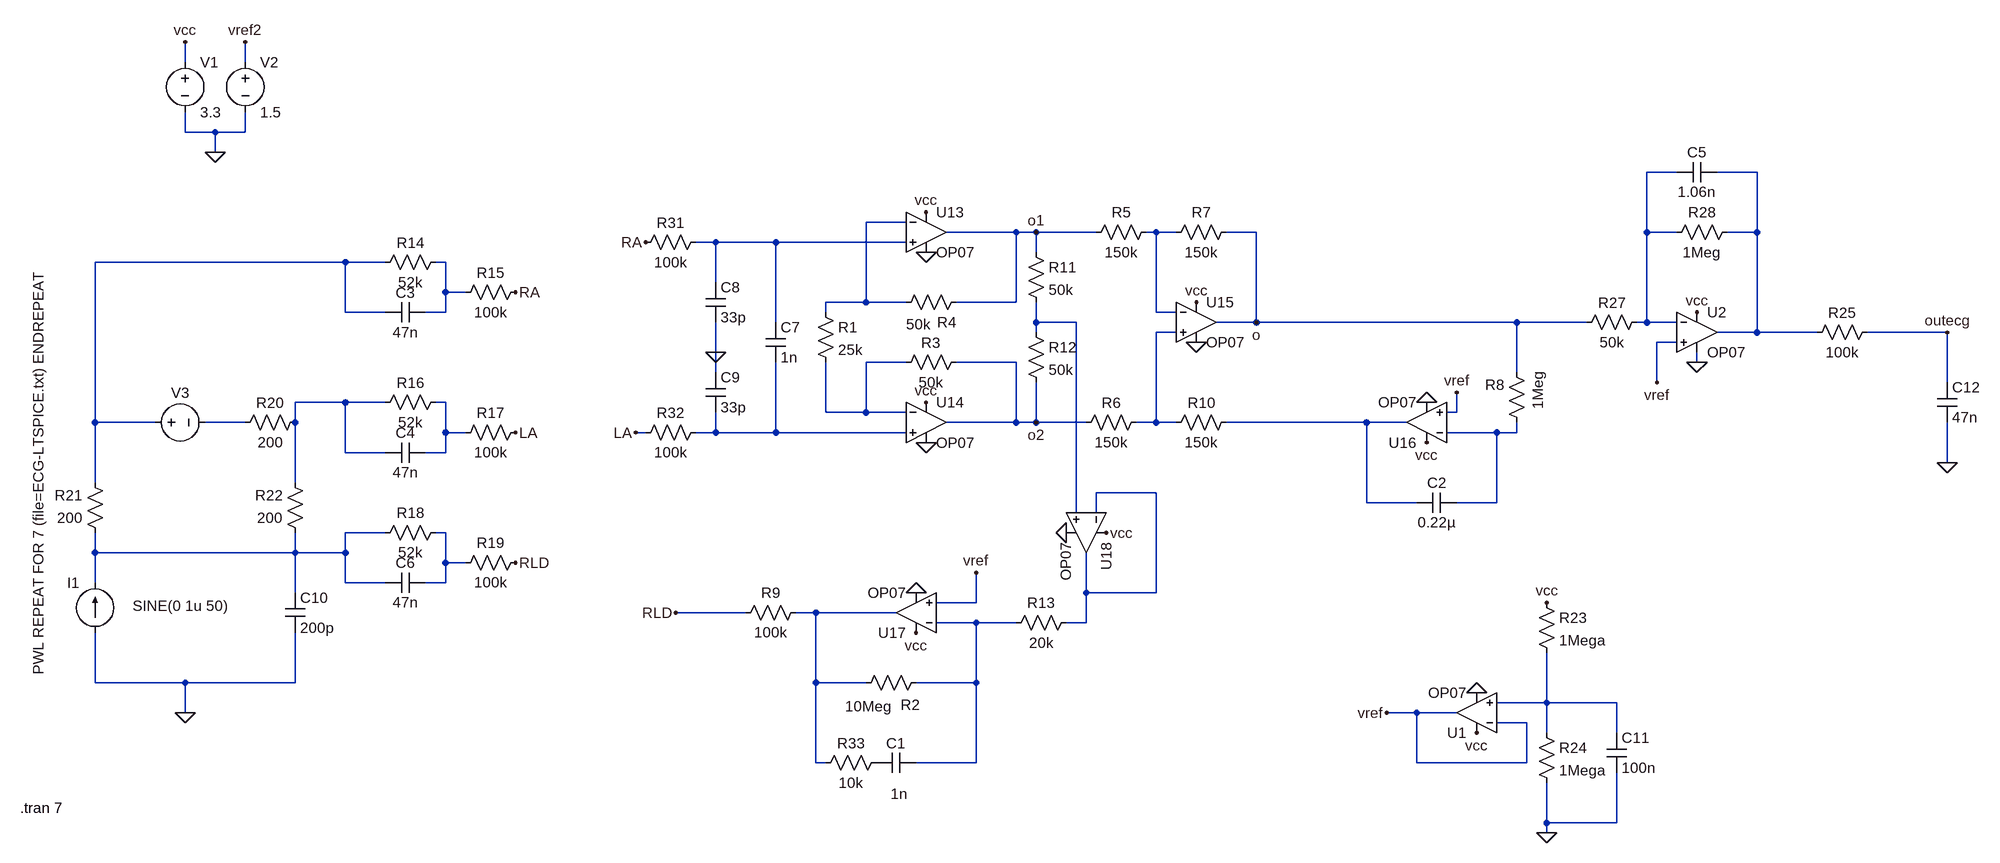
[diagram p0: schematic good circuit.asc]
good circuit.asc, the LTspice schematic file:
Version 4
SHEET 1 3136 1104
WIRE -1920 -208 -1920 -240
WIRE -1824 -208 -1824 -240
WIRE -1920 -96 -1920 -128
WIRE -1872 -96 -1920 -96
WIRE -1824 -96 -1824 -128
WIRE -1824 -96 -1872 -96
WIRE -1872 -64 -1872 -96
WIRE 464 -32 416 -32
WIRE 592 -32 528 -32
WIRE -768 48 -832 48
WIRE -592 64 -704 64
WIRE -560 64 -592 64
WIRE -464 64 -560 64
WIRE -368 64 -384 64
WIRE -336 64 -368 64
WIRE -208 64 -256 64
WIRE 416 64 416 -32
WIRE 464 64 416 64
WIRE 592 64 592 -32
WIRE 592 64 544 64
WIRE -1072 80 -1104 80
WIRE -976 80 -1072 80
WIRE -768 80 -976 80
WIRE -560 96 -560 64
WIRE -1664 112 -2064 112
WIRE -1600 112 -1664 112
WIRE -1504 112 -1520 112
WIRE -1072 144 -1072 80
WIRE -1504 160 -1504 112
WIRE -1472 160 -1504 160
WIRE -832 176 -832 48
WIRE -832 176 -896 176
WIRE -768 176 -832 176
WIRE -592 176 -592 64
WIRE -592 176 -688 176
WIRE -1664 192 -1664 112
WIRE -1600 192 -1664 192
WIRE -1504 192 -1504 160
WIRE -1504 192 -1536 192
WIRE -896 192 -896 176
WIRE -368 192 -368 64
WIRE -336 192 -368 192
WIRE -976 208 -976 80
WIRE -560 208 -560 176
WIRE -496 208 -560 208
WIRE -208 208 -208 64
WIRE -208 208 -272 208
WIRE 208 208 -208 208
WIRE 320 208 208 208
WIRE 416 208 416 64
WIRE 416 208 400 208
WIRE 464 208 416 208
WIRE -560 224 -560 208
WIRE -336 224 -368 224
WIRE 592 224 592 64
WIRE 592 224 528 224
WIRE 688 224 592 224
WIRE 896 224 768 224
WIRE 464 240 432 240
WIRE -1072 256 -1072 208
WIRE -768 272 -832 272
WIRE -592 272 -688 272
WIRE 496 272 496 256
WIRE -1072 288 -1072 256
WIRE 208 288 208 208
WIRE 432 304 432 240
WIRE 896 304 896 224
WIRE -1664 336 -1744 336
WIRE -1600 336 -1664 336
WIRE -1504 336 -1520 336
WIRE -896 352 -896 272
WIRE -832 352 -832 272
WIRE -832 352 -896 352
WIRE -768 352 -832 352
WIRE 112 352 112 320
WIRE 112 352 96 352
WIRE -2064 368 -2064 112
WIRE -1968 368 -2064 368
WIRE -1824 368 -1888 368
WIRE -1744 368 -1744 336
WIRE -592 368 -592 272
WIRE -592 368 -704 368
WIRE -560 368 -560 304
WIRE -560 368 -592 368
WIRE -480 368 -560 368
WIRE -368 368 -368 224
WIRE -368 368 -400 368
WIRE -336 368 -368 368
WIRE -32 368 -256 368
WIRE 32 368 -32 368
WIRE -1504 384 -1504 336
WIRE -1472 384 -1504 384
WIRE -1184 384 -1200 384
WIRE -1072 384 -1072 352
WIRE -1072 384 -1104 384
WIRE -976 384 -976 272
WIRE -976 384 -1072 384
WIRE -768 384 -976 384
WIRE 176 384 96 384
WIRE 208 384 208 368
WIRE 208 384 176 384
WIRE -1664 416 -1664 336
WIRE -1600 416 -1664 416
WIRE -1504 416 -1504 384
WIRE -1504 416 -1536 416
WIRE 896 432 896 368
WIRE -2064 464 -2064 368
WIRE -1744 464 -1744 368
WIRE -368 480 -464 480
WIRE -32 496 -32 368
WIRE 48 496 -32 496
WIRE 176 496 176 384
WIRE 176 496 112 496
WIRE -496 512 -496 208
WIRE -464 512 -464 480
WIRE -1600 544 -1664 544
WIRE -1504 544 -1520 544
WIRE -2064 576 -2064 544
WIRE -1744 576 -1744 544
WIRE -1744 576 -2064 576
WIRE -1664 576 -1664 544
WIRE -1664 576 -1744 576
WIRE -1504 592 -1504 544
WIRE -1472 592 -1504 592
WIRE -2064 624 -2064 576
WIRE -1664 624 -1664 576
WIRE -1600 624 -1664 624
WIRE -1504 624 -1504 592
WIRE -1504 624 -1536 624
WIRE -1744 640 -1744 576
WIRE -480 640 -480 576
WIRE -368 640 -368 480
WIRE -368 640 -480 640
WIRE -656 656 -656 608
WIRE -656 656 -720 656
WIRE -1024 672 -1136 672
WIRE -912 672 -944 672
WIRE -784 672 -912 672
WIRE -656 688 -720 688
WIRE -592 688 -656 688
WIRE -480 688 -480 640
WIRE -480 688 -512 688
WIRE -2064 784 -2064 704
WIRE -1920 784 -2064 784
WIRE -1744 784 -1744 704
WIRE -1744 784 -1920 784
WIRE -912 784 -912 672
WIRE -832 784 -912 784
WIRE -656 784 -656 688
WIRE -656 784 -752 784
WIRE 256 816 256 736
WIRE 256 816 176 816
WIRE 368 816 256 816
WIRE -1920 832 -1920 784
WIRE 48 832 0 832
WIRE 112 832 48 832
WIRE 224 848 176 848
WIRE 256 864 256 816
WIRE 368 864 368 816
WIRE -912 912 -912 784
WIRE -896 912 -912 912
WIRE -656 912 -656 784
WIRE -656 912 -752 912
WIRE 48 912 48 832
WIRE 224 912 224 848
WIRE 224 912 48 912
WIRE 256 1008 256 944
WIRE 368 1008 368 928
WIRE 368 1008 256 1008
WIRE 256 1024 256 1008
FLAG -1872 -64 0
FLAG -1920 -240 vcc
FLAG -656 608 vref
FLAG -752 640 0
FLAG -736 400 0
FLAG -736 96 0
FLAG -304 240 0
FLAG -736 32 vcc
FLAG -752 704 vcc
FLAG -736 336 vcc
FLAG -304 176 vcc
FLAG -560 64 o1
FLAG -560 368 o2
FLAG -448 544 vcc
FLAG -512 544 0
FLAG 64 400 vcc
FLAG 64 336 0
FLAG 112 320 vref
FLAG -208 208 o
FLAG 496 192 vcc
FLAG 496 272 0
FLAG 432 304 vref
FLAG -1072 256 0
FLAG -1920 832 0
FLAG -1392 160 RA
FLAG -1392 384 LA
FLAG -1392 592 RLD
FLAG -1184 80 RA
FLAG -1200 384 LA
FLAG -1136 672 RLD
FLAG 256 1024 0
FLAG 144 864 vcc
FLAG 144 800 0
FLAG 0 832 vref
FLAG 256 656 vcc
FLAG -1824 -240 vref2
FLAG 896 432 0
FLAG 896 224 outecg
SYMBOL res -912 176 R0
SYMATTR InstName R1
SYMATTR Value 25k
SYMBOL res -672 256 R90
WINDOW 0 0 56 VBottom 2
WINDOW 3 32 56 VTop 2
SYMATTR InstName R3
SYMATTR Value 50k
SYMBOL res -672 160 R90
WINDOW 0 63 31 VBottom 2
WINDOW 3 35 76 VTop 2
SYMATTR InstName R4
SYMATTR Value 50k
SYMBOL res -368 48 R90
WINDOW 0 0 56 VBottom 2
WINDOW 3 32 56 VTop 2
SYMATTR InstName R5
SYMATTR Value 150k
SYMBOL res -384 352 R90
WINDOW 0 0 56 VBottom 2
WINDOW 3 32 56 VTop 2
SYMATTR InstName R6
SYMATTR Value 150k
SYMBOL res -240 48 R90
WINDOW 0 0 56 VBottom 2
WINDOW 3 32 56 VTop 2
SYMATTR InstName R7
SYMATTR Value 150k
SYMBOL res -736 768 R90
WINDOW 0 67 25 VBottom 2
WINDOW 3 38 92 VTop 2
SYMATTR InstName R2
SYMATTR Value 10Meg
SYMBOL res -928 656 R90
WINDOW 0 0 56 VBottom 2
WINDOW 3 32 56 VTop 2
SYMATTR InstName R9
SYMATTR Value 100k
SYMBOL res -240 352 R90
WINDOW 0 0 56 VBottom 2
WINDOW 3 32 56 VTop 2
SYMATTR InstName R10
SYMATTR Value 150k
SYMBOL voltage -1920 -224 R0
WINDOW 123 0 0 Left 0
WINDOW 39 0 0 Left 0
SYMATTR InstName V1
SYMATTR Value 3.3
SYMBOL voltage -1824 -224 R0
WINDOW 123 0 0 Left 0
WINDOW 39 0 0 Left 0
SYMATTR InstName V2
SYMATTR Value 1.5
SYMBOL res -576 80 R0
SYMATTR InstName R11
SYMATTR Value 50k
SYMBOL res -576 208 R0
SYMATTR InstName R12
SYMATTR Value 50k
SYMBOL cap -752 896 R90
WINDOW 0 0 32 VBottom 2
WINDOW 3 50 27 VTop 2
SYMATTR InstName C1
SYMATTR Value 1n
SYMBOL res -496 672 R90
WINDOW 0 0 56 VBottom 2
WINDOW 3 32 56 VTop 2
SYMATTR InstName R13
SYMATTR Value 20k
SYMBOL res 224 384 R180
WINDOW 0 36 76 Left 2
WINDOW 3 -18 98 VLeft 2
SYMATTR InstName R8
SYMATTR Value 1Meg
SYMBOL cap 112 480 R90
WINDOW 0 0 32 VBottom 2
WINDOW 3 32 32 VTop 2
SYMATTR InstName C2
SYMATTR Value 0.22µ
SYMBOL OpAmps\\OP07 -736 0 R0
SYMATTR InstName U13
SYMBOL OpAmps\\OP07 -736 304 R0
SYMATTR InstName U14
SYMBOL OpAmps\\OP07 -304 144 R0
SYMATTR InstName U15
SYMBOL OpAmps\\OP07 64 432 R180
SYMATTR InstName U16
SYMBOL OpAmps\\OP07 -752 736 R180
SYMATTR InstName U17
SYMBOL OpAmps\\OP07 -416 544 R90
SYMATTR InstName U18
SYMBOL OpAmps\\OP07 496 160 R0
SYMATTR InstName U2
SYMBOL res 416 192 R90
WINDOW 0 0 56 VBottom 2
WINDOW 3 32 56 VTop 2
SYMATTR InstName R27
SYMATTR Value 50k
SYMBOL res 560 48 R90
WINDOW 0 0 56 VBottom 2
WINDOW 3 32 56 VTop 2
SYMATTR InstName R28
SYMATTR Value 1Meg
SYMBOL cap 528 -48 R90
WINDOW 0 0 32 VBottom 2
WINDOW 3 32 32 VTop 2
SYMATTR InstName C5
SYMATTR Value 1.06n
SYMBOL cap -992 208 R0
SYMATTR InstName C7
SYMATTR Value 1n
SYMBOL cap -1088 144 R0
SYMATTR InstName C8
SYMATTR Value 33p
SYMBOL cap -1088 288 R0
SYMATTR InstName C9
SYMATTR Value 33p
SYMBOL res -1088 64 R90
WINDOW 0 0 56 VBottom 2
WINDOW 3 32 56 VTop 2
SYMATTR InstName R31
SYMATTR Value 100k
SYMBOL res -1088 368 R90
WINDOW 0 0 56 VBottom 2
WINDOW 3 32 56 VTop 2
SYMATTR InstName R32
SYMATTR Value 100k
SYMBOL res -800 896 R90
WINDOW 0 0 56 VBottom 2
WINDOW 3 32 56 VTop 2
SYMATTR InstName R33
SYMATTR Value 10k
SYMBOL res -1616 128 R270
WINDOW 0 32 56 VTop 2
WINDOW 3 0 56 VBottom 2
SYMATTR InstName R14
SYMATTR Value 52k
SYMBOL cap -1536 176 R90
WINDOW 0 0 32 VBottom 2
WINDOW 3 32 32 VTop 2
SYMATTR InstName C3
SYMATTR Value 47n
SYMBOL res -1376 144 R90
WINDOW 0 0 56 VBottom 2
WINDOW 3 32 56 VTop 2
SYMATTR InstName R15
SYMATTR Value 100k
SYMBOL res -1616 352 R270
WINDOW 0 32 56 VTop 2
WINDOW 3 0 56 VBottom 2
SYMATTR InstName R16
SYMATTR Value 52k
SYMBOL cap -1536 400 R90
WINDOW 0 0 32 VBottom 2
WINDOW 3 32 32 VTop 2
SYMATTR InstName C4
SYMATTR Value 47n
SYMBOL res -1376 368 R90
WINDOW 0 0 56 VBottom 2
WINDOW 3 32 56 VTop 2
SYMATTR InstName R17
SYMATTR Value 100k
SYMBOL res -1616 560 R270
WINDOW 0 32 56 VTop 2
WINDOW 3 0 56 VBottom 2
SYMATTR InstName R18
SYMATTR Value 52k
SYMBOL cap -1536 608 R90
WINDOW 0 0 32 VBottom 2
WINDOW 3 32 32 VTop 2
SYMATTR InstName C6
SYMATTR Value 47n
SYMBOL res -1376 576 R90
WINDOW 0 0 56 VBottom 2
WINDOW 3 32 56 VTop 2
SYMATTR InstName R19
SYMATTR Value 100k
SYMBOL voltage -1984 368 R270
WINDOW 0 32 56 VTop 2
WINDOW 3 -81 -155 Bottom 2
SYMATTR InstName V3
SYMATTR Value PWL REPEAT FOR 7 (file=ECG-LTSPICE.txt) ENDREPEAT
SYMBOL res -1728 352 R90
WINDOW 0 0 56 VBottom 2
WINDOW 3 32 56 VTop 2
SYMATTR InstName R20
SYMATTR Value 200
SYMBOL res -2048 560 R180
WINDOW 0 36 76 Left 2
WINDOW 3 36 40 Left 2
SYMATTR InstName R21
SYMATTR Value 200
SYMBOL res -1728 560 R180
WINDOW 0 36 76 Left 2
WINDOW 3 36 40 Left 2
SYMATTR InstName R22
SYMATTR Value 200
SYMBOL current -2064 704 R180
WINDOW 0 24 80 Left 2
WINDOW 3 -213 43 Left 2
WINDOW 123 0 0 Left 0
WINDOW 39 0 0 Left 0
SYMATTR InstName I1
SYMATTR Value SINE(0 1u 50)
SYMBOL cap -1760 640 R0
SYMATTR InstName C10
SYMATTR Value 200p
SYMBOL OpAmps\\OP07 144 896 R180
SYMATTR InstName U1
SYMBOL res 240 640 R0
SYMATTR InstName R23
SYMATTR Value 1Mega
SYMBOL res 240 848 R0
SYMATTR InstName R24
SYMATTR Value 1Mega
SYMBOL cap 352 864 R0
SYMATTR InstName C11
SYMATTR Value 100n
SYMBOL res 784 208 R90
WINDOW 0 0 56 VBottom 2
WINDOW 3 32 56 VTop 2
SYMATTR InstName R25
SYMATTR Value 100k
SYMBOL cap 880 304 R0
SYMATTR InstName C12
SYMATTR Value 47n
TEXT -2184 984 Left 2 !.tran 7

The netlist it stands for:
* good circuit.asc
R1 N003 N010 25k
R3 o2 N010 50k
R4 o1 N003 50k
R5 N004 o1 150k
R6 N009 o2 150k
R7 o N004 150k
R2 N021 N020 10Meg
R9 N020 RLD 100k
R10 N014 N009 150k
V1 vcc 0 3.3
V2 vref2 0 1.5
R11 o1 N008 50k
R12 N008 o2 50k
C1 N021 P001 1n
R13 N017 N021 20k
R8 N016 o 1Meg
C2 N016 N014 0.22µ
XU13 N005 N003 vcc 0 o1 LT1001  ; OP07, pins In+ In- V+ V- OUT
XU14 N015 N010 vcc 0 o2 LT1001  ; OP07, pins In+ In- V+ V- OUT
XU15 N009 N004 vcc 0 o LT1001  ; OP07, pins In+ In- V+ V- OUT
XU16 vref N016 vcc 0 N014 LT1001  ; OP07, pins In+ In- V+ V- OUT
XU17 vref N021 vcc 0 N020 LT1001  ; OP07, pins In+ In- V+ V- OUT
XU18 N008 N017 vcc 0 N017 LT1001  ; OP07, pins In+ In- V+ V- OUT
XU2 vref N001 vcc 0 N002 LT1001  ; OP07, pins In+ In- V+ V- OUT
R27 N001 o 50k
R28 N002 N001 1Meg
C5 N002 N001 1.06n
C7 N005 N015 1n
C8 N005 0 33p
C9 0 N015 33p
R31 N005 RA 100k
R32 N015 LA 100k
R33 P001 N020 10k
R14 N006 N007 52k
C3 N007 N006 47n
R15 RA N007 100k
R16 N011 N012 52k
C4 N012 N011 47n
R17 LA N012 100k
R18 N018 N019 52k
C6 N019 N018 47n
R19 RLD N019 100k
V3 N006 N013 PWL REPEAT FOR 7 (file=ECG-LTSPICE.txt) ENDREPEAT
R20 N011 N013 200
R21 N018 N006 200
R22 N018 N011 200
I1 0 N018 SINE(0 1u 50)
C10 N018 0 200p
XU1 N022 vref vcc 0 vref LT1001  ; OP07, pins In+ In- V+ V- OUT
R23 vcc N022 1Mega
R24 N022 0 1Mega
C11 N022 0 100n
R25 outecg N002 100k
C12 outecg 0 47n
.tran 7
.lib LTC.lib
.backanno
.end